# Altium project 2018CAR.PRJPCB
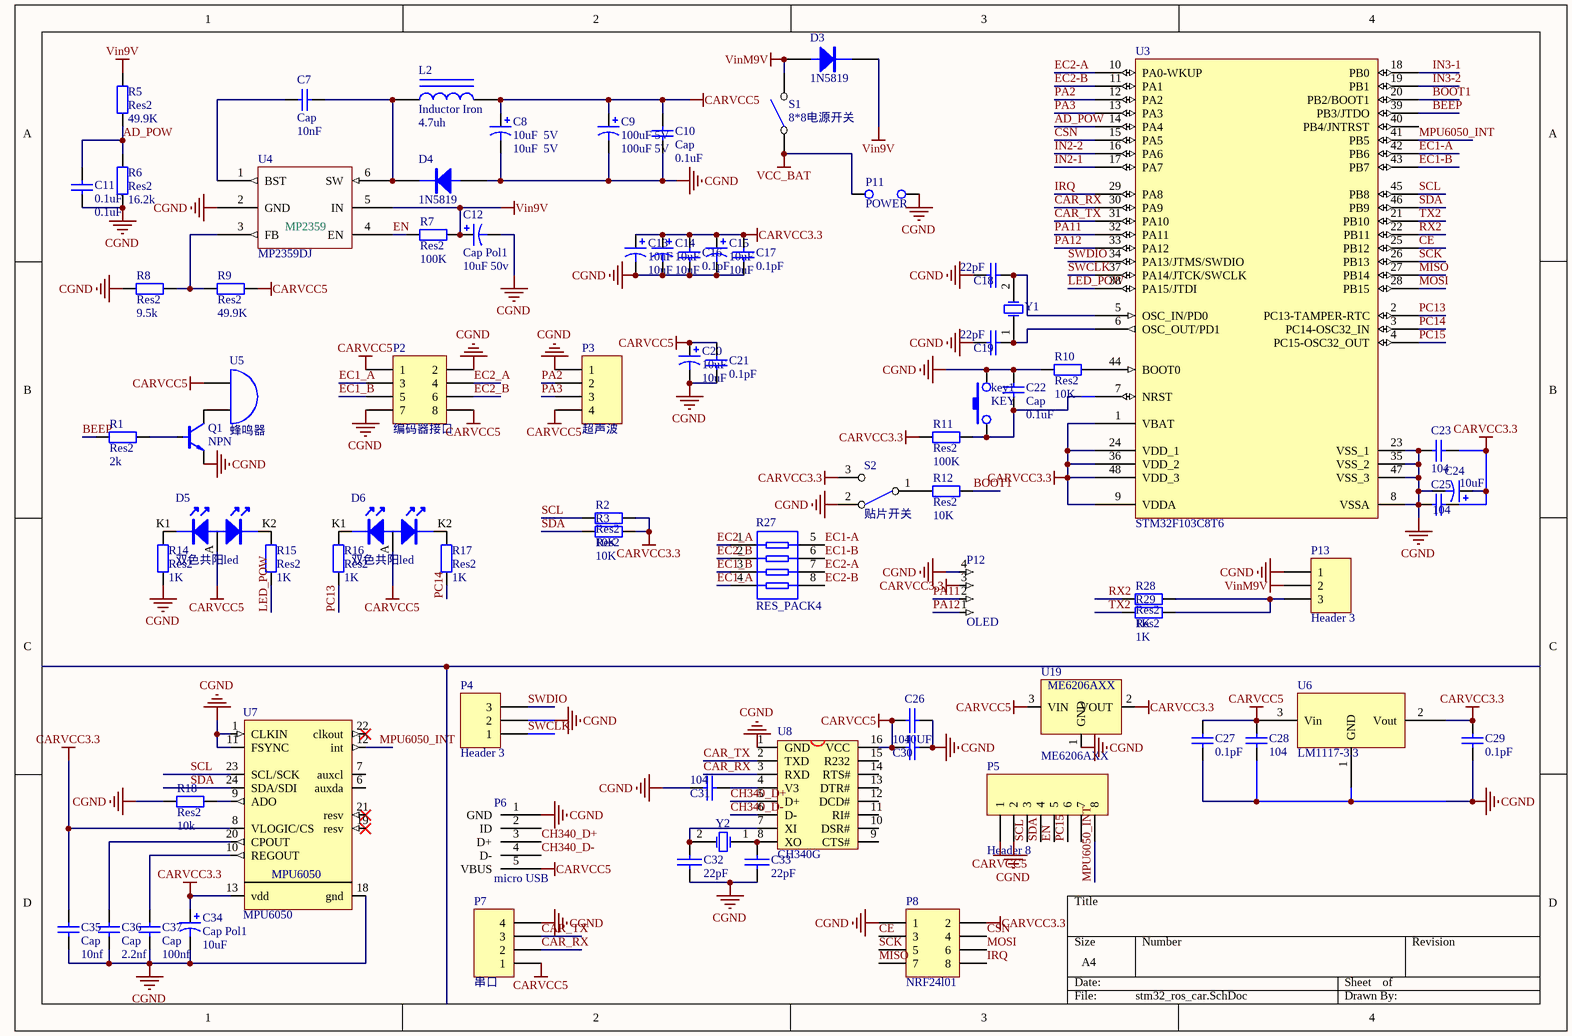
[diagram p0: stm32_ros_car.SchDoc]
6 sheets, 201 parts. Net scope: global (net labels, ports and power ports of the same name join across sheets).
Board file: ROS_CAR.PcbDoc
Sheets:
  stm32_ros_car.SchDoc
  电机码盘.SchDoc
  电机驱动.SchDoc
  OLED096.SchDoc
  ESP_12主板.SchDoc
  moto2.SchDoc

## Sheet stm32_ros_car.SchDoc
size A4

### Parts
C7  Cap  value 10nF  [LC-0603_C]
C8  10uF  5V  [LC-1210_C]
C9  100uF 5V  [电容HONOR_63X77]
C10  Cap  value 0.1uF  [LC-0603_C]
C11  0.1uF  [LC-0603_C]
C12  Cap Pol1  value 10uF 50v  [电容HONOR_63X54]
C13  10uF  [电容HONOR_63X77]
C14  10uF  [LC-1210_C]
C15  10uF  [LC-1210_C]
C16  value 0.1pF  [LC-0603_C]  (hidden comment: Cap)
C17  value 0.1pF  [LC-0603_C]  (hidden comment: Cap)
C18  value 22pF  [LC-0603_C]  (hidden comment: CAP)
C19  value 22pF  [LC-0603_C]  (hidden comment: CAP)
C20  10uF  [LC-1210_C]
C21  value 0.1pF  [LC-0603_C]  (hidden comment: Cap)
C22  Cap  value 0.1uF  [LC-0603_C]
C23  value 104  [LC-0603_C]  (hidden comment: Cap)
C24  value 10uF  [LC-1210_C]
C25  value 104  [LC-0603_C]  (hidden comment: Cap)
C26  value 10UF  [LC-0603_C]  (hidden comment: CAP)
C27  value 0.1pF  [LC-0603_C]  (hidden comment: Cap)
C28  value 104  [LC-1210_C]  (hidden comment: Cap)
C29  value 0.1pF  [LC-0603_C]  (hidden comment: Cap)
C30  value 104  [LC-1206_C]  (hidden comment: CAP)
C31  value 104  [LC-0603_C]  (hidden comment: CAP)
C32  value 22pF  [LC-0603_C]  (hidden comment: CAP)
C33  value 22pF  [LC-0603_C]  (hidden comment: CAP)
C34  Cap Pol1  value 10uF  [LC-1210_C]
C35  Cap  value 10nf  [LC-0603_C]
C36  Cap  value 2.2nf  [LC-0603_C]
C37  Cap  value 100nf  [LC-0603_C]
D3  1N5819  [SMA]
D4  1N5819  [SMA]
D5  双色共阳led  [共阳双色LED]
D6  双色共阳led  [共阳双色LED]
key1  KEY  [SMD轻触按键]
L2  Inductor Iron  value 4.7uh  [电感GDCD4532]
P2  编码器接口  [HDR2X4]
P3  超声波  [HDR1X4]
P4  Header 3  [HDR1X3]
P5  Header 8  [HDR1X8]
P6  micro USB  [micro 5P沉板式0.8四脚全插无导位有孔]
P7  串口  [HDR1X4]
P8  NRF24l01  [HDR2X4]
P11  POWER  [电源]
P12  OLED  [1.0MM 翻盖 下接 FPC连接器 4P]
P13  Header 3  [AMP 3针连接件]
Q1  NPN  [LC-SOT-23]
R1  Res2  value 2k  [LC-0603_R]
R2  Res2  value 10K  [LC-0603_R]
R3  Res2  value 10K  [LC-0603_R]
R5  Res2  value 49.9K  [LC-0603_R]
R6  Res2  value 16.2k  [LC-0603_R]
R7  Res2  value 100K  [LC-0603_R]
R8  Res2  value 9.5k  [LC-0603_R]
R9  Res2  value 49.9K  [LC-0603_R]
R10  Res2  value 10K  [LC-0603_R]
R11  Res2  value 100K  [LC-0603_R]
R12  Res2  value 10K  [LC-0603_R]
R14  Res2  value 1K  [LC-0603_R]
R15  Res2  value 1K  [LC-0603_R]
R16  Res2  value 1K  [LC-0603_R]
R17  Res2  value 1K  [LC-0603_R]
R18  Res2  value 10k  [LC-0603_R]
R27  RES_PACK4  [RES4]
R28  Res2  value 1K  [LC-0603_R]
R29  Res2  value 1K  [LC-0603_R]
S1  8*8电源开关  [8*8自锁开关]
S2  贴片开关  [KEY]
U3  STM32F103C8T6  [LQFP48_L]
U4  MP2359DJ  [LC-SOT-23-6]
U5  蜂鸣器  [BELL]
U6  LM1117-3.3  [SOT223]
U7  MPU6050  [QFN24]
U8  CH340G  [SOP16M]
U19  ME6206AXX  [LC-SOT-89]
Y1  12MHz  [49SMD]  (value not drawn)
Y2  12MHz  [49SMD]  (value not drawn)

### Nets
CARVCC3.3: C13.1 C14.1 C15.1 C16.1 C17.1 C23.1 C24.1 C25.1 C29.1 C34.1 C35.2 P8.2 P12.3 R2.1 R3.1 R11.1 S2.3(NO1) U3.1(VBAT) U3.9(VDDA) U3.24(VDD_1) U3.36(VDD_2) U3.48(VDD_3) U6.2(Vout) U7.8(VLOGIC/CS) U7.13(vdd) U19.2(VOUT)
CARVCC5: C8.1 C9.1 C10.2 C20.1 C21.1 C26.2 C27.1 C28.2 C30.1 D5.A D6.A L2.2 P2.1 P2.8 P3.4 P5.1 P6.5(VBUS) P7.1 R9.1 U5.1(A) U6.3(Vin) U8.16(VCC) U19.3(VIN)
CGND: C8.2 C9.2 C10.1 C11.2 C12.2 C13.2 C14.2 C15.2 C16.2 C17.2 C18.1 C19.1 C20.2 C21.2 C22.2 C23.2 C24.2 C25.2 C26.1 C27.2 C28.1 C29.2 C30.2 C31.1 C32.1 C33.1 C34.2 C35.1 C36.1 C37.1 D4.A key1.2 P2.2 P2.7 P3.1 P4.2 P5.2 P6.1(GND) P7.4 P8.1 P11.2 P12.4 P13.1 Q1.E(e) R6.2 R8.2 R10.1 R14.1 R18.2 S2.2(NC1) U3.8(VSSA) U3.23(VSS_1) U3.35(VSS_2) U3.47(VSS_3) U4.2(GND) U6.1(GND) U7.1(CLKIN) U7.11(FSYNC) U7.18(gnd) U8.1(GND) U19.1(GND)
VCC_BAT: P11.1 S1.1(COMMON1)
Vin9V: C12.1 D3.K R5.1 R7.2 U4.5(IN)
VinM9V: D3.A P13.2 S1.2(NC1)
AD_POW: C11.1 R5.2 R6.1 U3.14(PA4)
BEEP: R1.2 U3.39(PB3/JTDO)
BOOT1: R12.1 U3.20(PB2/BOOT1)
CAR_RX: P7.2 U3.30(PA9) U8.3(RXD)
CAR_TX: P7.3 U3.31(PA10) U8.2(TXD)
CE: P8.3 U3.25(PB12)
CH340_D+: P6.3(D+) U8.5(D+)
CH340_D-: P6.4(D-) U8.6(D-)
CSN: P8.4 U3.15(PA5)
EC1-A: R27.5 U3.42(PB6)
EC1-B: R27.6 U3.43(PB7)
EC1_A: P2.3 R27.4
EC1_B: P2.5 R27.3
EC2-A: R27.7 U3.10(PA0-WKUP)
EC2-B: R27.8 U3.11(PA1)
EC2_A: P2.4 R27.1
EC2_B: P2.6 R27.2
EN: P5.5 R7.1 U4.4(EN)
IN2-1: U3.17(PA7)
IN2-2: U3.16(PA6)
IN3-1: U3.18(PB0)
IN3-2: U3.19(PB1)
IRQ: P8.8 U3.29(PA8)
LED_POW: R15.1 U3.38(PA15/JTDI)
MISO: P8.7 U3.27(PB14)
MOSI: P8.6 U3.28(PB15)
MPU6050_INT: P5.8 U3.41(PB5) U7.12(int)
PA2: P3.2 U3.12(PA2)
PA3: P3.3 U3.13(PA3)
PA11: P12.2 U3.32(PA11)
PA12: P12.1 U3.33(PA12)
PC13: R16.1 U3.2(PC13-TAMPER-RTC)
PC14: R17.1 U3.3(PC14-OSC32_IN)
PC15: P5.6 U3.4(PC15-OSC32_OUT)
RX2: R28.1 U3.22(PB11)
SCK: P8.5 U3.26(PB13)
SCL: P5.3 R2.2 U3.45(PB8) U7.23(SCL/SCK)
SDA: P5.4 R3.2 U3.46(PB9) U7.24(SDA/SDI)
SWCLK: P4.1 U3.37(PA14/JTCK/SWCLK)
SWDIO: P4.3 U3.34(PA13/JTMS/SWDIO)
TX2: R29.1 U3.21(PB10)
NetC7_1: C7.1 U4.1(BST)
NetC7_2: C7.2 D4.K L2.1 U4.6(SW)
NetC18_2: C18.2 U3.5(OSC_IN/PD0) Y1.2(OSC2)
NetC19_2: C19.2 U3.6(OSC_OUT/PD1) Y1.1(OSC1)
NetC22_1: C22.1 key1.1 R11.2 U3.7(NRST)
NetC31_2: C31.2 U8.4(V3)
NetC32_2: C32.2 U8.7(XI) Y2.2(OSC2)
NetC33_2: C33.2 U8.8(XO) Y2.1(OSC1)
NetC36_2: C36.2 U7.20(CPOUT)
NetC37_2: C37.2 U7.10(REGOUT)
NetD5_K1: D5.K1 R14.2
NetD5_K2: D5.K2 R15.2
NetD6_K1: D6.K1 R16.2
NetD6_K2: D6.K2 R17.2
NetP13_3: P13.3 R28.2 R29.2
NetQ1_B: Q1.B(b) R1.1
NetQ1_C: Q1.C(c) U5.2(B)
NetR8_1: R8.1 R9.2 U4.3(FB)
NetR10_2: R10.2 U3.44(BOOT0)
NetR12_2: R12.2 S2.1(COMMON1)
NetR18_1: R18.1 U7.9(ADO)

Not connected (* = marked no-connect by the designer): P5 7; P6 2(ID); U3 40(PB4/JNTRST); U7 6(auxda) 7(auxcl) 19(resv)* 21(resv)* 22(clkout)*; U8 9(CTS#) 10(DSR#) 11(RI#) 12(DCD#) 13(DTR#) 14(RTS#) 15(R232)

### Notes on the sheet
- (in symbol MP2359DJ) MP2359

### Library data of the parts
C7 C10 C11 C16 C17 C21-C23 C25 C27-C29 C35-C37 = Cap: Capacitor; Published: 8-Jun-2000; LatestRevisionDate: 17-Jul-2002; LatestRevisionNote: Re-released for DXP Platform.; PackageReference: RAD-0.3; Publisher: Altium Limited
  C11: Value: 0.1uF
C8 C9 C12-C15 C20 C24 C34 = Cap Pol1: Polarized Capacitor (Radial); Published: 8-Jun-2000; LatestRevisionDate: 17-Jul-2002; LatestRevisionNote: Re-released for DXP Platform.; PackageReference: RB7.6-15; Publisher: Altium Limited
  C8: Value: 10uF  5V
  C9: Value: 100uF 5V
  C13-C15 C20: Value: 10uF
D3 D4 = 1N4001: pin to pad: A>1 K>2
D5 D6 = 双色共阳led: pin to pad: A>2 K1>1 K2>3
L2 = Inductor Iron: Magnetic-Core Inductor; Published: 24-Mar-1999; LatestRevisionDate: 17-Jul-2002; LatestRevisionNote: Re-released for DXP Platform.; PackageReference: AXIAL-0.9; Publisher: Altium Limited
P2 P8 = Header 4X2: Header, 4-Pin, Dual row; LatestRevisionDate: 17-Jul-2002; LatestRevisionNote: Re-released for DXP Platform.; Publisher: Altium Limited
P3 P7 = Header 4: Header, 4-Pin; LatestRevisionDate: 17-Jul-2002; LatestRevisionNote: Re-released for DXP Platform.; Publisher: Altium Limited
P4 P13 = Header 3: Header, 3-Pin; LatestRevisionDate: 17-Jul-2002; LatestRevisionNote: Re-released for DXP Platform.; Publisher: Altium Limited
P5 = Header 8: Header, 8-Pin; LatestRevisionDate: 17-Jul-2002; LatestRevisionNote: Re-released for DXP Platform.; Publisher: Altium Limited
P6 = micro 5P
P12 = FPC 4P 1MM
Q1 = NPN: pin to pad: B>1 C>3 E>2
R1-R3 R5-R12 R14-R18 R28 R29 = Res2: Resistor; Published: 8-Jun-2000; LatestRevisionDate: 17-Jul-2002; LatestRevisionNote: Re-released for DXP Platform.; PackageReference: AXIAL-0.4; Publisher: Altium Limited
S1 = 8*8电源开关: pin to pad: 1>2 2>1
S2 = 贴片开关: pin to pad: 1>2 2>1
U3 = STM32F103C8T6: STM32 ARM-based 32-bit MCU with 64 Kbytes Flash, 48-pin LQFP, Industrial Temperature; Published: 30-May-2008; DatasheetVersion: rev6, Mar-2008; PackageVersion: Mar-2008; PackageReference: LQFP48; Publisher: Altium Limited; PackageDescription: 48-Pin Low-Profile Quad Flat Pack, 7 x 7 mm Body, 0.5 mm Pitch (LQFP48); ComponentLink1Description: Manufacturer Link; ComponentLink1URL: www.st.com/stm32; ComponentLink2Description: Datasheet; ComponentLink2URL: http://www.st.com/stonline/products/literature/ds/13587.pdf
U5 = 蜂鸣器: Bell
U8 = CH340G: USB2UART
Y1 Y2 = XTAL: Crystal Oscillator; Value: 8MHZ; Published: 8-Jun-2000; LatestRevisionDate: 17-Jul-2002; LatestRevisionNote: Re-released for DXP Platform.; Publisher: Altium Limited

## Sheet 电机码盘.SchDoc
size A4
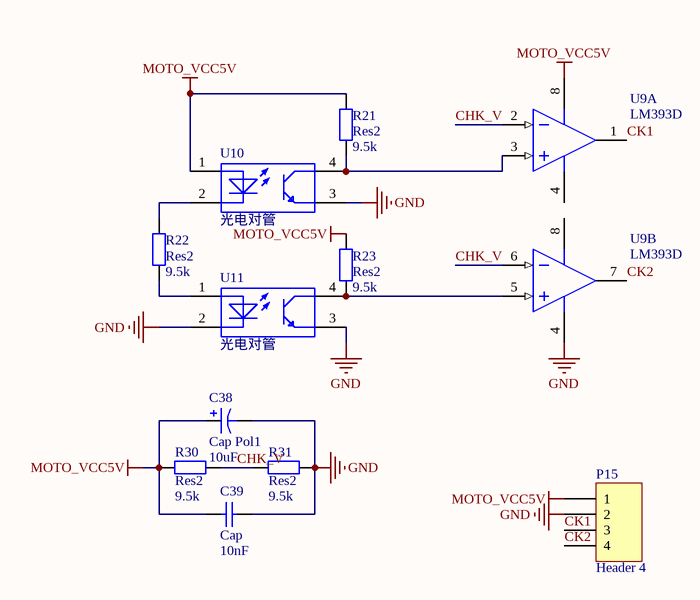
[diagram p1: 电机码盘.SchDoc]

### Parts
C38  Cap Pol1  value 10uF  [LC-1210_C]
C39  Cap  value 10nF  [LC-0603_C]
P15  Header 4  [HDR1X4]
R21  Res2  value 9.5k  [LC-0603_R]
R22  Res2  value 9.5k  [LC-0603_R]
R23  Res2  value 9.5k  [LC-0603_R]
R30  Res2  value 9.5k  [LC-0603_R]
R31  Res2  value 9.5k  [LC-0603_R]
U9  LM393D  [SO8_N]  (parts A,B of 2)
U10  光电对管  [马达光电对管]
U11  光电对管  [马达光电对管]

### Nets
GND: C38.2 C39.2 P15.2 R31.2 U9.4(V-) U10.3 U11.2 U11.3
MOTO_VCC5V: C38.1 C39.1 P15.1 R21.1 R23.1 R30.1 U9.8(V+) U10.1
CHK_V: R30.2 R31.1 U9.2(IN-) U9.6(IN-)
CK1: P15.3 U9.1(OUT)
CK2: P15.4 U9.7(OUT)
NetR21_2: R21.2 U9.3(IN+) U10.4
NetR22_1: R22.1 U10.2
NetR22_2: R22.2 U11.1
NetR23_2: R23.2 U9.5(IN+) U11.4

### Library data of the parts
C38 = Cap Pol1: Polarized Capacitor (Radial); Published: 8-Jun-2000; LatestRevisionDate: 17-Jul-2002; LatestRevisionNote: Re-released for DXP Platform.; PackageReference: RB7.6-15; Publisher: Altium Limited
C39 = Cap: Capacitor; Published: 8-Jun-2000; LatestRevisionDate: 17-Jul-2002; LatestRevisionNote: Re-released for DXP Platform.; PackageReference: RAD-0.3; Publisher: Altium Limited
P15 = Header 4: Header, 4-Pin; LatestRevisionDate: 17-Jul-2002; LatestRevisionNote: Re-released for DXP Platform.; Publisher: Altium Limited
R21-R23 R30 R31 = Res2: Resistor; Published: 8-Jun-2000; LatestRevisionDate: 17-Jul-2002; LatestRevisionNote: Re-released for DXP Platform.; PackageReference: AXIAL-0.4; Publisher: Altium Limited
U9 = LM393D: Low-Power Dual Voltage Comparator; Published: 24-Aug-2001; LatestRevisionDate: 13-Apr-2006; LatestRevisionNote: IPC-7351 Footprint Added.; DatasheetVersion: Jun-1998; PackageVersion: Dec-2002; PackageReference: SO8; Publisher: Altium Limited; PackageDescription: 8-Pin Small Outline Integrated Circuit 1.27 mm Pitch; Code_JEDEC: MS-012-AA; Code_IPC: SOIC127P600-8; ComponentLink1Description: Manufacturer Link; ComponentLink1URL: http://www.st.com/; ComponentLink2Description: Datasheet; ComponentLink2URL: http://www.st.com/stonline/products/literature/ds/2164/lm293.pdf

## Sheet 电机驱动.SchDoc
size A4
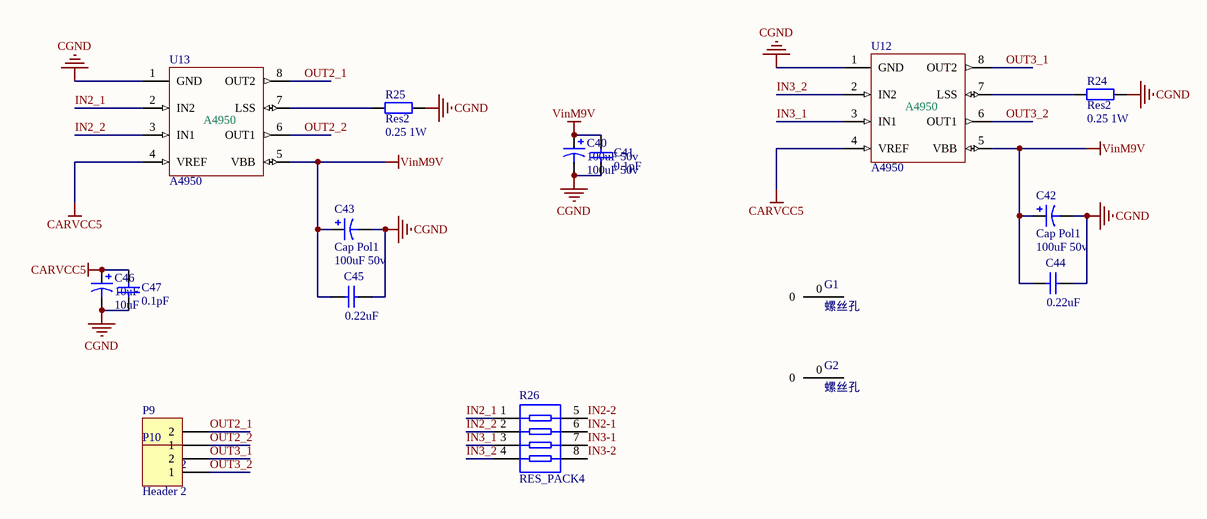
[diagram p2: 电机驱动.SchDoc]

### Parts
C40  100uF 50v  [电容HONOR_63X77]
C41  value 0.1pF  [LC-0603_C]  (hidden comment: Cap)
C42  Cap Pol1  value 100uF 50v  [100UF]
C43  Cap Pol1  value 100uF 50v  [100UF]
C44  value 0.22uF  [LC-0603_C]
C45  value 0.22uF  [LC-0603_C]
C46  10uF  [电容HONOR_63X77]
C47  value 0.1pF  [LC-0603_C]  (hidden comment: Cap)
G1  螺丝孔  [M3螺丝孔]
G2  螺丝孔  [M3螺丝孔]
P9  Header 2  [HDR1X2]
P10  Header 2  [HDR1X2]
R24  Res2  value 0.25 1W  [LC-2512_R]
R25  Res2  value 0.25 1W  [LC-2512_R]
R26  RES_PACK4  [RES4]
U12  A4950  [LC-SOIC-8_150mil]
U13  A4950  [LC-SOIC-8_150mil]

### Nets
CARVCC5: C46.1 C47.1 U12.4(VREF) U13.4(VREF)
CGND: C40.2 C41.2 C42.2 C43.2 C44.2 C45.2 C46.2 C47.2 R24.2 R25.2 U12.1(GND) U13.1(GND)
VinM9V: C40.1 C41.1 C42.1 C43.1 C44.1 C45.1 U12.5(VBB) U13.5(VBB)
IN2-1: R26.6
IN2-2: R26.5
IN2_1: R26.1 U13.2(IN2)
IN2_2: R26.2 U13.3(IN1)
IN3-1: R26.7
IN3-2: R26.8
IN3_1: R26.3 U12.3(IN1)
IN3_2: R26.4 U12.2(IN2)
OUT2_1: P9.2 U13.8(OUT2)
OUT2_2: P9.1 U13.6(OUT1)
OUT3_1: P10.2 U12.8(OUT2)
OUT3_2: P10.1 U12.6(OUT1)
NetR24_1: R24.1 U12.7(LSS)
NetR25_1: R25.1 U13.7(LSS)

Not connected (* = marked no-connect by the designer): G1 0; G2 0

### Library data of the parts
C40 C42 C43 C46 = Cap Pol1: Polarized Capacitor (Radial); Published: 8-Jun-2000; LatestRevisionDate: 17-Jul-2002; LatestRevisionNote: Re-released for DXP Platform.; PackageReference: RB7.6-15; Publisher: Altium Limited
  C40: Value: 100uF 50v
  C46: Value: 10uF
C41 C44 C45 C47 = Cap: Capacitor; Published: 8-Jun-2000; LatestRevisionDate: 17-Jul-2002; LatestRevisionNote: Re-released for DXP Platform.; PackageReference: RAD-0.3; Publisher: Altium Limited
P9 P10 = Header 2: Header, 2-Pin; LatestRevisionDate: 17-Jul-2002; LatestRevisionNote: Re-released for DXP Platform.; Publisher: Altium Limited
R24 R25 = Res2: Resistor; Published: 8-Jun-2000; LatestRevisionDate: 17-Jul-2002; LatestRevisionNote: Re-released for DXP Platform.; PackageReference: AXIAL-0.4; Publisher: Altium Limited

## Sheet OLED096.SchDoc
size A4
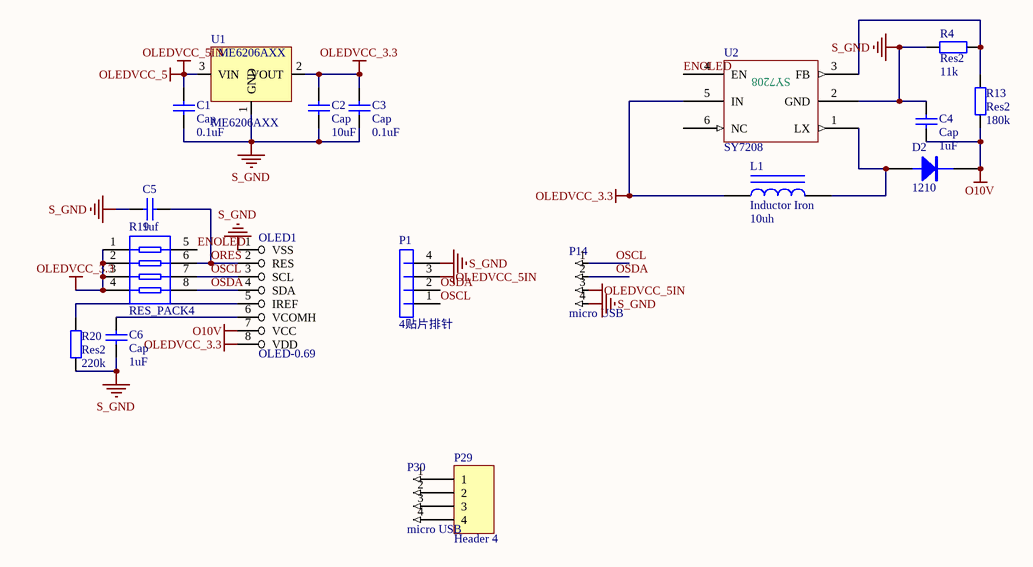
[diagram p3: OLED096.SchDoc]

### Parts
C1  Cap  value 0.1uF  [6-0805]
C2  Cap  value 10uF  [6-0805]
C3  Cap  value 0.1uF  [6-0805]
C4  Cap  value 1uF  [LC-0603_C]
C5  value 1uf  [LC-0603_C]  (hidden comment: Cap)
C6  Cap  value 1uF  [LC-0603_C]
D2  1210  [LC-1206_L]
L1  Inductor Iron  value 10uh  [LC-0805_L]
OLED1  OLED-0.69  [OLED-0.69]
P1  4贴片排针  [4针贴片接头2.0]
P14  micro USB  [1.0MM 翻盖 下接 FPC连接器 4P]
P29  Header 4  [HDR1X4]
P30  micro USB  [1.0MM 翻盖 下接 FPC连接器 4P]
R4  Res2  value 11k  [LC-0603_R]
R13  Res2  value 180k  [LC-0603_R]
R19  RES_PACK4  [RES4]
R20  Res2  value 220k  [LC-0603_R]
U1  ME6206AXX  [sot23]
U2  SY7208  [LC-SOT-23-6]

### Nets
O10V: C4.1 D2.K OLED1.7(VCC) R13.1
OLEDVCC_3.3: C2.1 C3.1 L1.1 OLED1.8(VDD) R19.1 R19.2 R19.3 R19.4 U1.2(VOUT) U2.5(IN)
OLEDVCC_5: C1.1 P1.3 P14.3 U1.3(VIN)  [also labelled OLEDVCC_5IN]
S_GND: C1.2 C2.2 C3.2 C4.2 C5.1 C6.2 OLED1.1(VSS) P1.4 P14.4 R4.2 R20.1 U1.1(GND) U2.2(GND)
ENOLED: R19.5 U2.4(EN)
ORES: C5.2 OLED1.2(RES) R19.6
OSCL: OLED1.3(SCL) P1.1 P14.1 R19.7
OSDA: OLED1.4(SDA) P1.2 P14.2 R19.8
NetC6_1: C6.1 OLED1.6(VCOMH)
NetD2_A: D2.A L1.2 U2.1(LX)
NetOLED1_5: OLED1.5(IREF) R20.2
NetP29_1: P29.1 P30.1
NetP29_2: P29.2 P30.2
NetP29_3: P29.3 P30.3
NetP29_4: P29.4 P30.4
NetR4_1: R4.1 R13.2 U2.3(FB)

Not connected (* = marked no-connect by the designer): U2 6(NC)

### Library data of the parts
C1-C6 = Cap: Capacitor; Published: 8-Jun-2000; LatestRevisionDate: 17-Jul-2002; LatestRevisionNote: Re-released for DXP Platform.; PackageReference: RAD-0.3; Publisher: Altium Limited
D2 = 1N4001: pin to pad: A>1 K>2
L1 = Inductor Iron: Magnetic-Core Inductor; Published: 24-Mar-1999; LatestRevisionDate: 17-Jul-2002; LatestRevisionNote: Re-released for DXP Platform.; PackageReference: AXIAL-0.9; Publisher: Altium Limited
OLED1 = OLED-0.69: pin to pad: 1>8 2>7 3>6 4>5 5>4 6>3 7>2 8>1
P14 P30 = FPC 4P 1MM
P29 = Header 4: Header, 4-Pin; LatestRevisionDate: 17-Jul-2002; LatestRevisionNote: Re-released for DXP Platform.; Publisher: Altium Limited
R4 R13 R20 = Res2: Resistor; Published: 8-Jun-2000; LatestRevisionDate: 17-Jul-2002; LatestRevisionNote: Re-released for DXP Platform.; PackageReference: AXIAL-0.4; Publisher: Altium Limited
U1 = ME6206AXX: pin to pad: 1>3 3>1

## Sheet ESP_12主板.SchDoc
size A4
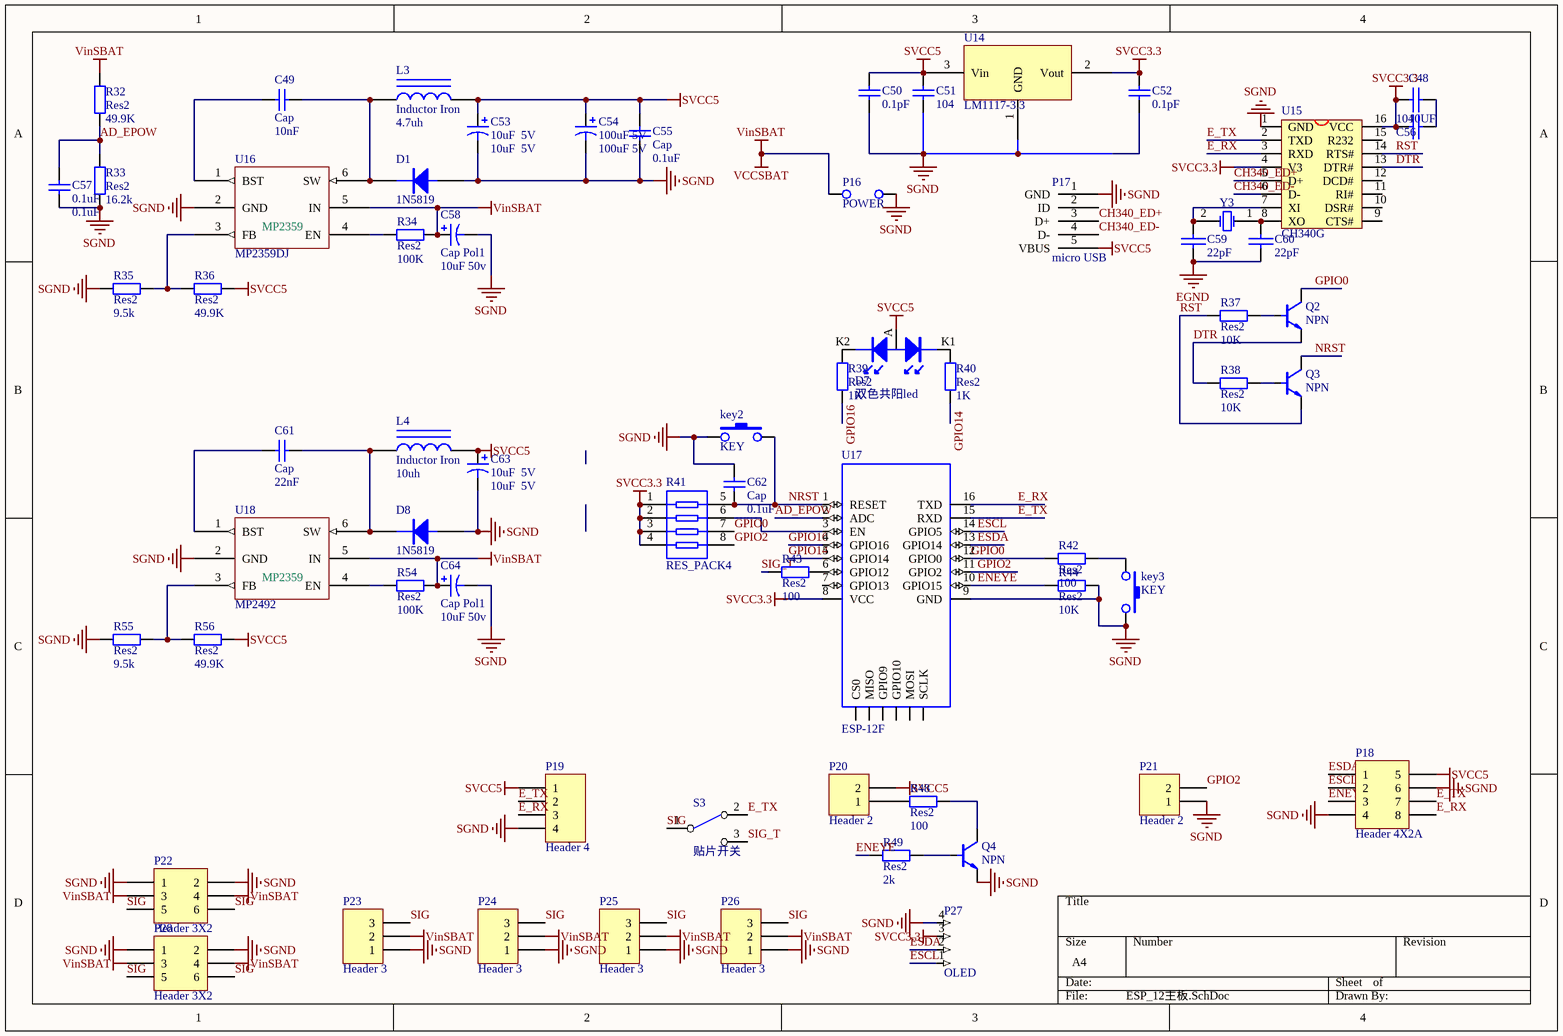
[diagram p4: ESP_12主板.SchDoc]

### Parts
C48  value 10UF  [LC-0603_C]  (hidden comment: CAP)
C49  Cap  value 10nF  [LC-0603_C]
C50  value 0.1pF  [LC-0603_C]  (hidden comment: Cap)
C51  value 104  [LC-1210_C]  (hidden comment: Cap)
C52  value 0.1pF  [LC-0603_C]  (hidden comment: Cap)
C53  10uF  5V  [LC-1210_C]
C54  100uF 5V  [电容HONOR_63X77]
C55  Cap  value 0.1uF  [LC-0603_C]
C56  value 104  [LC-1206_C]  (hidden comment: CAP)
C57  0.1uF  [LC-0603_C]
C58  Cap Pol1  value 10uF 50v  [电容HONOR_63X54]
C59  value 22pF  [LC-0603_C]  (hidden comment: CAP)
C60  value 22pF  [LC-0603_C]  (hidden comment: CAP)
C61  Cap  value 22nF  [LC-0603_C]
C62  Cap  value 0.1uF  [LC-0603_C]
C63  10uF  5V  [LC-1210_C]
C64  Cap Pol1  value 10uF 50v  [电容HONOR_63X54]
D1  1N5819  [SMA]
D7  双色共阳led  [共阳双色LED]
D8  1N5819  [SMA]
key2  KEY  [SMD轻触按键]
key3  KEY  [SMD轻触按键]
L3  Inductor Iron  value 4.7uh  [电感GDCD4532]
L4  Inductor Iron  value 10uh  [电感GDCD4532]
P16  POWER  [电源]
P17  micro USB  [micro 5P沉板式0.8四脚全插无导位有孔]
P18  Header 4X2A  [HDR2X4_CEN]
P19  Header 4  [HDR1X4]
P20  Header 2  [HDR1X2]
P21  Header 2  [HDR1X2]
P22  Header 3X2  [HDR2X3]
P23  Header 3  [AMP 3针连接件]
P24  Header 3  [AMP 3针连接件]
P25  Header 3  [AMP 3针连接件]
P26  Header 3  [AMP 3针连接件]
P27  OLED  [1.0MM 翻盖 下接 FPC连接器 4P]
P28  Header 3X2  [HDR2X3]
Q2  NPN  [LC-SOT-23]
Q3  NPN  [LC-SOT-23]
Q4  NPN  [LC-SOT-23]
R32  Res2  value 49.9K  [LC-0603_R]
R33  Res2  value 16.2k  [LC-0603_R]
R34  Res2  value 100K  [LC-0603_R]
R35  Res2  value 9.5k  [LC-0603_R]
R36  Res2  value 49.9K  [LC-0603_R]
R37  Res2  value 10K  [LC-0603_R]
R38  Res2  value 10K  [LC-0603_R]
R39  Res2  value 1K  [LC-0603_R]
R40  Res2  value 1K  [LC-0603_R]
R41  RES_PACK4  [RES4]
R42  Res2  value 100  [LC-0603_R]
R43  Res2  value 100  [LC-0603_R]
R44  Res2  value 10K  [LC-0603_R]
R48  Res2  value 100  [LC-0603_R]
R49  Res2  value 2k  [LC-0603_R]
R54  Res2  value 100K  [LC-0603_R]
R55  Res2  value 9.5k  [LC-0603_R]
R56  Res2  value 49.9K  [LC-0603_R]
S3  贴片开关  [KEY]
U14  LM1117-3.3  [SOT223]
U15  CH340G  [SOP16M]
U16  MP2359DJ  [LC-SOT-23-6]
U17  ESP-12F  [ESP_12]
U18  MP2492  [LC-SOT-23-6]
Y3  12MHz  [49SMD]  (value not drawn)

### Nets
EGND: C59.1 C60.1
SGND: C50.2 C51.1 C52.2 C53.2 C54.2 C55.1 C57.2 C58.2 C62.2 C63.2 C64.2 D1.A D8.A key2.1 key3.2 P16.2 P17.1(GND) P18.4 P18.6 P19.4 P21.1 P22.1 P22.2 P23.1 P24.1 P25.1 P26.1 P27.4 P28.1 P28.2 Q4.E(e) R33.2 R35.2 R44.2 R55.2 U14.1(GND) U15.1(GND) U16.2(GND) U17.9(GND) U18.2(GND)
SVCC3.3: C48.2 C52.1 C56.1 P27.3 R41.1 R41.2 R41.3 R41.4 U14.2(Vout) U15.4(V3) U15.16(VCC) U17.8(VCC)
SVCC5: C50.1 C51.2 C53.1 C54.1 C55.2 C63.1 D7.A L3.2 L4.2 P17.5(VBUS) P18.5 P19.1 P20.2 R36.1 R56.1 U14.3(Vin)
VCCSBAT: C58.1 C64.1 P16.1 P22.3 P22.4 P23.2 P24.2 P25.2 P26.2 P28.3 P28.4 R32.1 R34.2 R54.2 U16.5(IN) U18.5(IN)  [also labelled VinSBAT]
AD_EPOW: C57.1 R32.2 R33.1 U17.2(ADC)
CH340_ED+: P17.3(D+) U15.5(D+)
CH340_ED-: P17.4(D-) U15.6(D-)
DTR: Q2.E(e) R38.1 U15.13(DTR#)
E_RX: P18.8 P19.3 U15.3(RXD) U17.16(TXD)
E_TX: P18.7 P19.2 S3.2(NC1) U15.2(TXD) U17.15(RXD)
ENEYE: P18.3 R44.1 R49.2 U17.10(GPIO15)
ESCL: P18.2 P27.1 U17.14(GPIO5)
ESDA: P18.1 P27.2 U17.13(GPIO14)
GPIO0: Q2.C(c) R41.7 R42.1 U17.12(GPIO0)
GPIO2: P21.2 R41.8 U17.11(GPIO2)
GPIO14: R40.1 U17.5(GPIO14)
GPIO16: R39.1 U17.4(GPIO16)
NRST: C62.1 key2.2 Q3.C(c) R41.5 U17.1(RESET)
RST: Q3.E(e) R37.1 U15.14(RTS#)
SIG: P22.5 P22.6 P23.3 P24.3 P25.3 P26.3 P28.5 P28.6 S3.1(COMMON1)
SIG_T: R43.1 S3.3(NO1)
NetC48_1: C48.1 C56.2
NetC49_1: C49.1 U16.1(BST)
NetC49_2: C49.2 D1.K L3.1 U16.6(SW)
NetC59_2: C59.2 U15.7(XI) Y3.2(OSC2)
NetC60_2: C60.2 U15.8(XO) Y3.1(OSC1)
NetC61_1: C61.1 U18.1(BST)
NetC61_2: C61.2 D8.K L4.1 U18.6(SW)
NetD7_K1: D7.K1 R40.2
NetD7_K2: D7.K2 R39.2
Netkey3_1: key3.1 R42.2
NetP20_1: P20.1 R48.1
NetQ2_B: Q2.B(b) R37.2
NetQ3_B: Q3.B(b) R38.2
NetQ4_B: Q4.B(b) R49.1
NetQ4_C: Q4.C(c) R48.2
NetR34_1: R34.1 U16.4(EN)
NetR35_1: R35.1 R36.2 U16.3(FB)
NetR41_6: R41.6 U17.3(EN)
NetR43_2: R43.2 U17.6(GPIO12)
NetR54_1: R54.1 U18.4(EN)
NetR55_1: R55.1 R56.2 U18.3(FB)

Not connected (* = marked no-connect by the designer): P17 2(ID); U15 9(CTS#) 10(DSR#) 11(RI#) 12(DCD#) 15(R232); U17 7(GPIO13) 17(CS0) 18(MISO) 19(GPIO9) 20(GPIO10) 21(MOSI) 22(SCLK)

### Notes on the sheet
- (in symbol MP2359DJ) MP2359

### Library data of the parts
C49-C52 C55 C57 C61 C62 = Cap: Capacitor; Published: 8-Jun-2000; LatestRevisionDate: 17-Jul-2002; LatestRevisionNote: Re-released for DXP Platform.; PackageReference: RAD-0.3; Publisher: Altium Limited
  C57: Value: 0.1uF
C53 C54 C58 C63 C64 = Cap Pol1: Polarized Capacitor (Radial); Published: 8-Jun-2000; LatestRevisionDate: 17-Jul-2002; LatestRevisionNote: Re-released for DXP Platform.; PackageReference: RB7.6-15; Publisher: Altium Limited
  C53 C63: Value: 10uF  5V
  C54: Value: 100uF 5V
D1 D8 = 1N4001: pin to pad: A>1 K>2
D7 = 双色共阳led: pin to pad: A>2 K1>1 K2>3
L3 L4 = Inductor Iron: Magnetic-Core Inductor; Published: 24-Mar-1999; LatestRevisionDate: 17-Jul-2002; LatestRevisionNote: Re-released for DXP Platform.; PackageReference: AXIAL-0.9; Publisher: Altium Limited
P17 = micro 5P
P18 = Header 4X2A: Header, 4-Pin, Dual row; LatestRevisionDate: 17-Jul-2002; LatestRevisionNote: Re-released for DXP Platform.; Publisher: Altium Limited
P19 = Header 4: Header, 4-Pin; LatestRevisionDate: 17-Jul-2002; LatestRevisionNote: Re-released for DXP Platform.; Publisher: Altium Limited
P20 P21 = Header 2: Header, 2-Pin; LatestRevisionDate: 17-Jul-2002; LatestRevisionNote: Re-released for DXP Platform.; Publisher: Altium Limited
P22 P28 = Header 3X2: Header, 3-Pin, Dual row; LatestRevisionDate: 17-Jul-2002; LatestRevisionNote: Re-released for DXP Platform.; Publisher: Altium Limited
P23-P26 = Header 3: Header, 3-Pin; LatestRevisionDate: 17-Jul-2002; LatestRevisionNote: Re-released for DXP Platform.; Publisher: Altium Limited
P27 = FPC 4P 1MM
Q2-Q4 = NPN: pin to pad: B>1 C>3 E>2
R32-R40 R42-R44 R48 R49 R54-R56 = Res2: Resistor; Published: 8-Jun-2000; LatestRevisionDate: 17-Jul-2002; LatestRevisionNote: Re-released for DXP Platform.; PackageReference: AXIAL-0.4; Publisher: Altium Limited
S3 = 贴片开关: pin to pad: 1>2 2>1
U15 = CH340G: USB2UART
U18 = MP2359DJ
Y3 = XTAL: Crystal Oscillator; Value: 8MHZ; Published: 8-Jun-2000; LatestRevisionDate: 17-Jul-2002; LatestRevisionNote: Re-released for DXP Platform.; Publisher: Altium Limited

## Sheet moto2.SchDoc
size A4
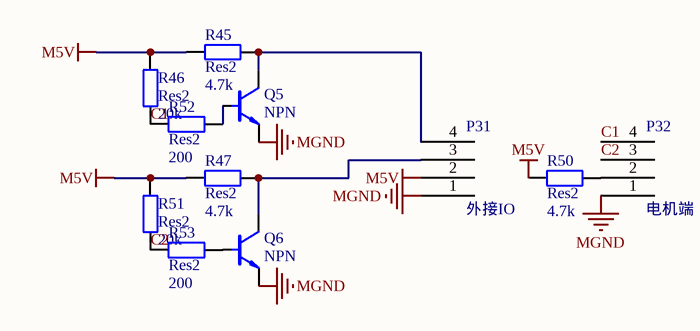
[diagram p5: moto2.SchDoc]

### Parts
P31  外接IO  [4针贴片接头2.0]
P32  电机端  [4针贴片接头2.0]
Q5  NPN  [LC-SOT-23]
Q6  NPN  [LC-SOT-23]
R45  Res2  value 4.7k  [LC-0603_R]
R46  Res2  value 20k  [LC-0603_R]
R47  Res2  value 4.7k  [LC-0603_R]
R50  Res2  value 4.7k  [LC-0603_R]
R51  Res2  value 20k  [LC-0603_R]
R52  Res2  value 200  [LC-0603_R]
R53  Res2  value 200  [LC-0603_R]

### Nets
M5V: P31.2 R45.1 R46.2 R47.1 R50.1 R51.2
MGND: P31.1 P32.1 Q5.E(e) Q6.E(e)
C1: P32.4 R46.1 R52.2
C2: P32.3 R51.1 R53.2
NetP31_3: P31.3 Q6.C(c) R47.2
NetP31_4: P31.4 Q5.C(c) R45.2
NetP32_2: P32.2 R50.2
NetQ5_B: Q5.B(b) R52.1
NetQ6_B: Q6.B(b) R53.1

### Library data of the parts
P31 P32 = 4线焊接点
Q5 Q6 = NPN: pin to pad: B>1 C>3 E>2
R45-R47 R50-R53 = Res2: Resistor; Published: 8-Jun-2000; LatestRevisionDate: 17-Jul-2002; LatestRevisionNote: Re-released for DXP Platform.; PackageReference: AXIAL-0.4; Publisher: Altium Limited

## Nets that join several sheets
CARVCC5: stm32_ros_car (23 pins), 电机驱动 (C46.1 C47.1 U12.4 U13.4)
CGND: stm32_ros_car (61 pins), 电机驱动 (12 pins)
VinM9V: stm32_ros_car (D3.A P13.2 S1.2), 电机驱动 (8 pins)
IN2-1: stm32_ros_car (U3.17), 电机驱动 (R26.6)
IN2-2: stm32_ros_car (U3.16), 电机驱动 (R26.5)
IN3-1: stm32_ros_car (U3.18), 电机驱动 (R26.7)
IN3-2: stm32_ros_car (U3.19), 电机驱动 (R26.8)